# EAGLE design EngineCard (EAGLE 9.6.2)
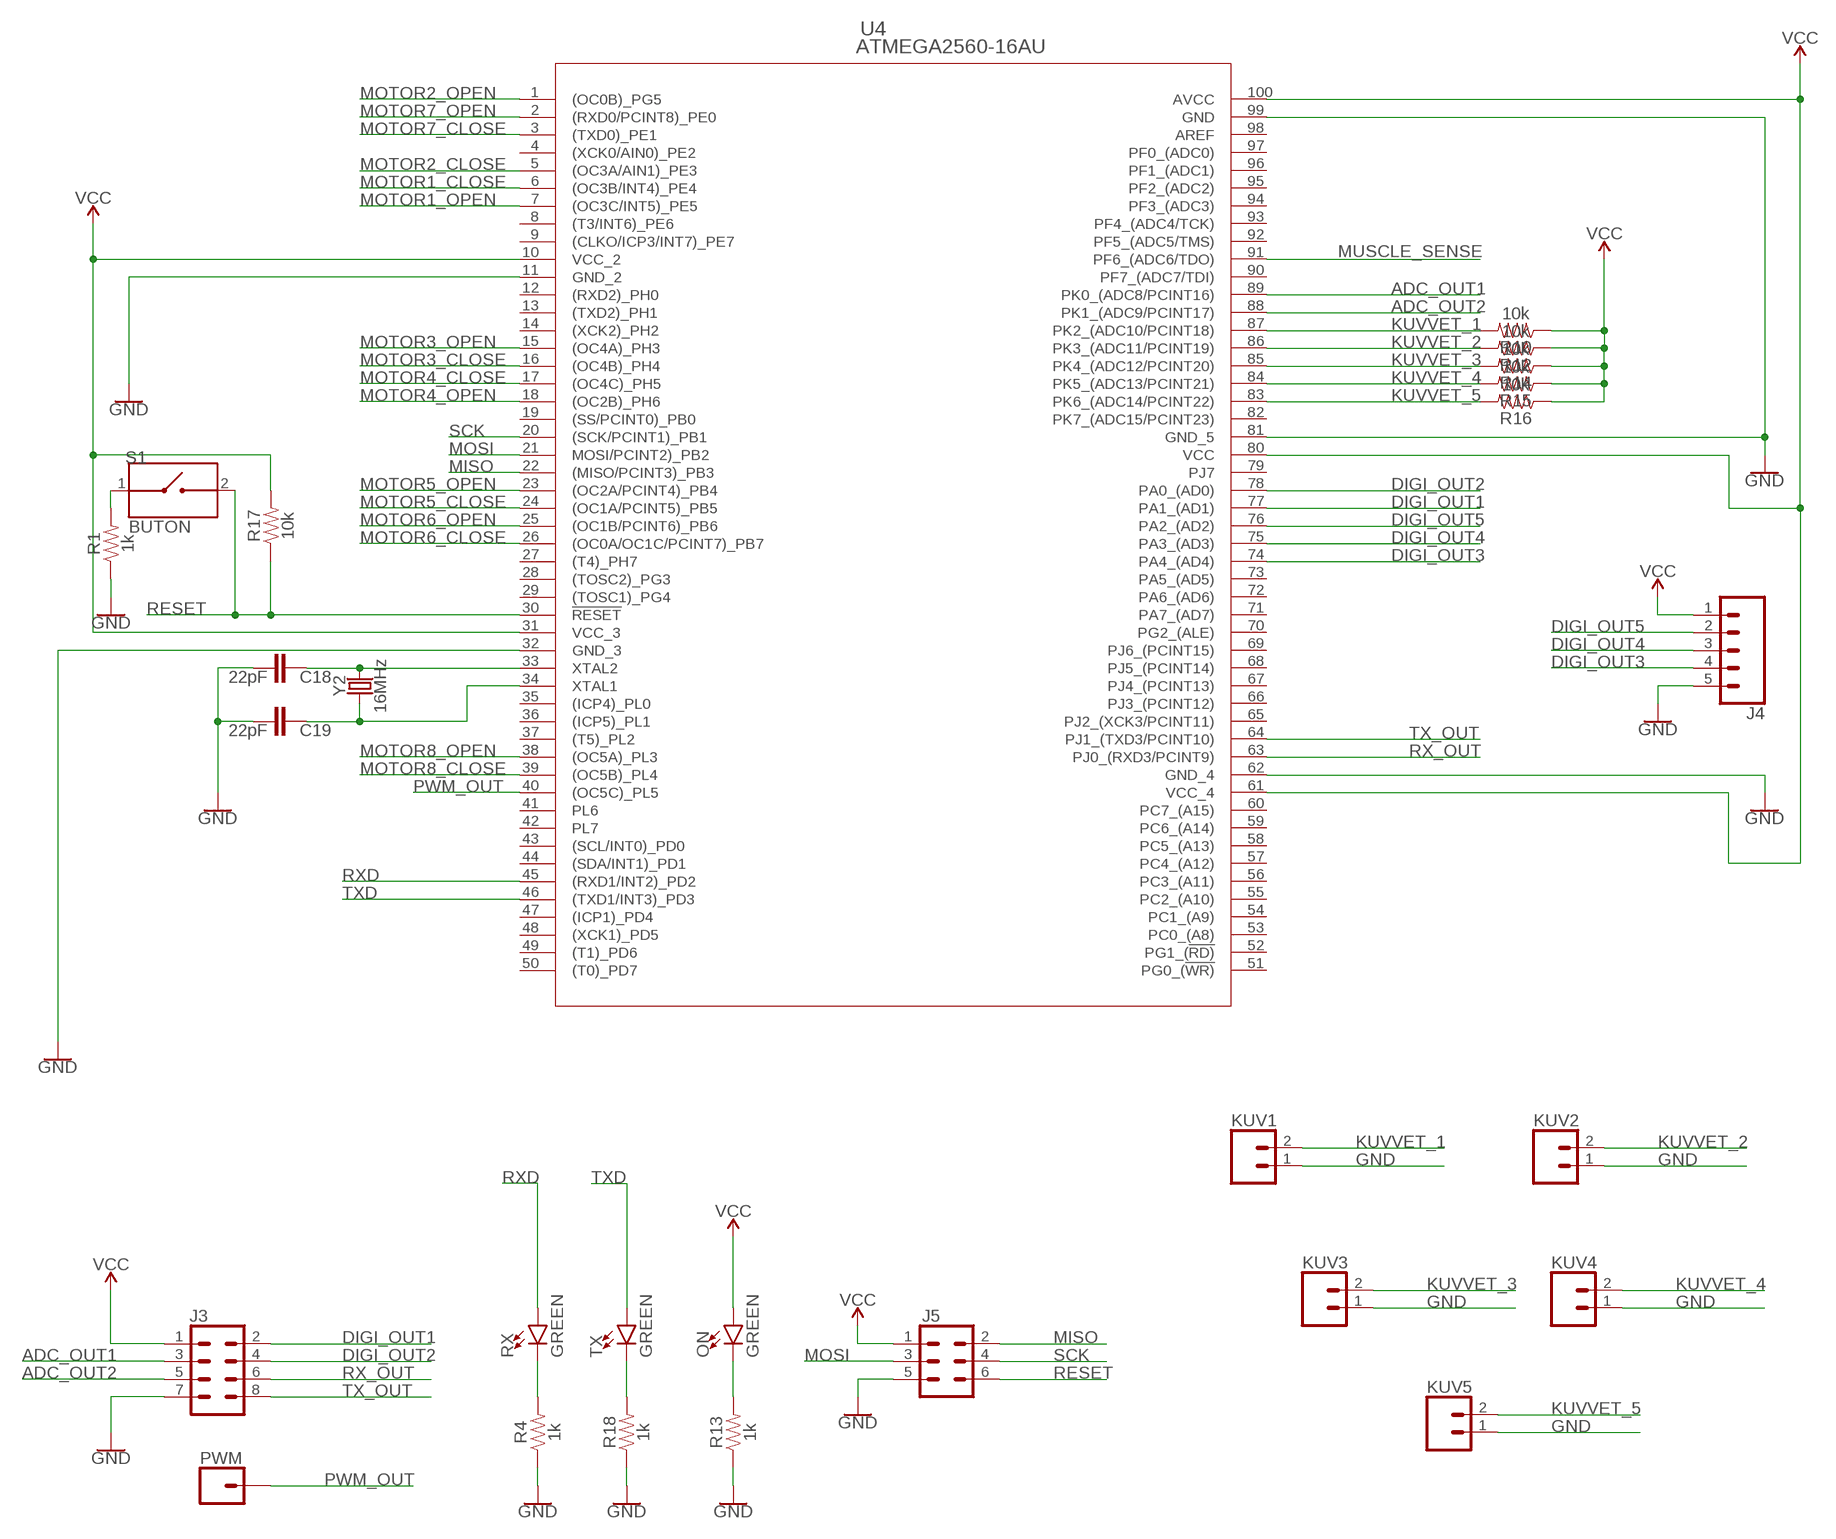
[diagram p0: schematic, sheet 1, part 1 of 2]
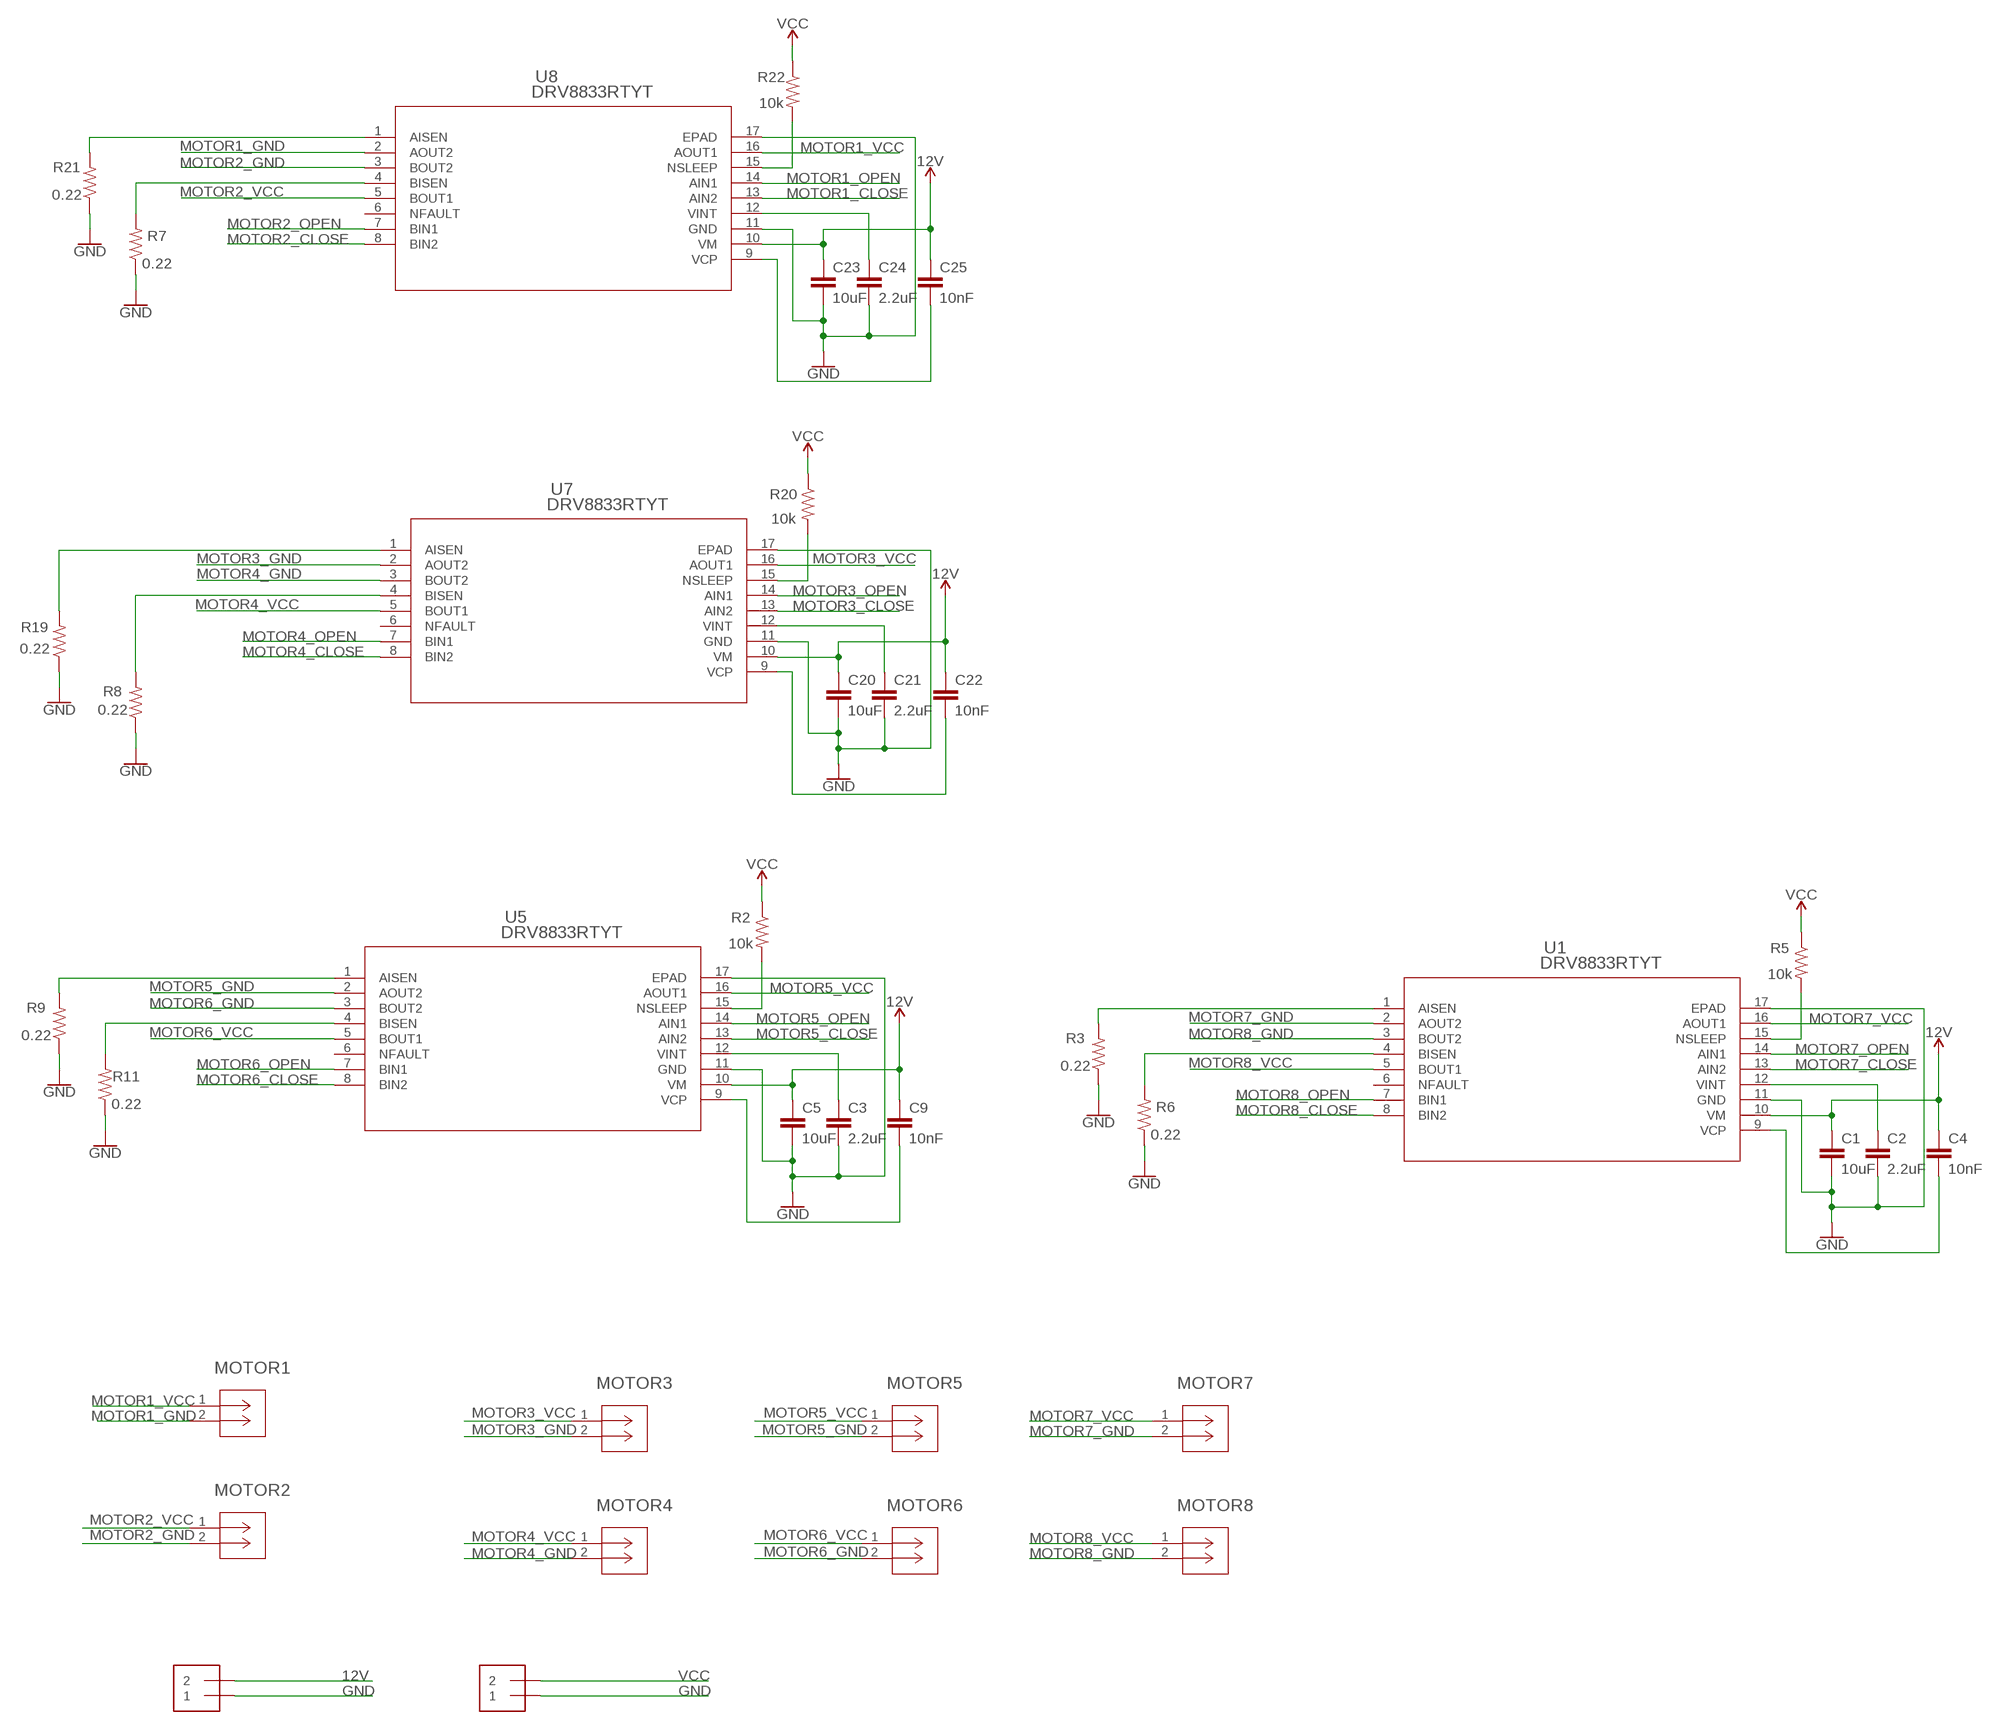
[diagram p1: schematic, sheet 1, part 2 of 2]

## Parts
C1  10uF  10UF-0603-6.3V-20%  [0603]
C2  2.2uF  2.2UF-0603-10V-20%  [0603]
C3  2.2uF  2.2UF-0603-10V-20%  [0603]
C4  10nF  10NF-0603-50V-10%  [0603]
C5  10uF  10UF-0603-6.3V-20%  [0603]
C9  10nF  10NF-0603-50V-10%  [0603]
C18  22pF  22PF-0603-50V-5%  [0603]
C19  22pF  22PF-0603-50V-5%  [0603]
C20  10uF  10UF-0603-6.3V-20%  [0603]
C21  2.2uF  2.2UF-0603-10V-20%  [0603]
C22  10nF  10NF-0603-50V-10%  [0603]
C23  10uF  10UF-0603-6.3V-20%  [0603]
C24  2.2uF  2.2UF-0603-10V-20%  [0603]
C25  10nF  10NF-0603-50V-10%  [0603]
J3  CONN_04X2  [2X4]
J4  CONN_05NO_SILK  [1X05_NO_SILK]
J5  CONN_03X2NO_SILK  [2X3-NS]
KUV1  CONN_02  [1X02]
KUV2  CONN_02  [1X02]
KUV3  CONN_02  [1X02]
KUV4  CONN_02  [1X02]
KUV5  CONN_02  [1X02]
MOTOR1  530470210  [CON_530470210_MOL]
MOTOR2  530470210  [CON_530470210_MOL]
MOTOR3  530470210  [CON_530470210_MOL]
MOTOR4  530470210  [CON_530470210_MOL]
MOTOR5  530470210  [CON_530470210_MOL]
MOTOR6  530470210  [CON_530470210_MOL]
MOTOR7  530470210  [CON_530470210_MOL]
MOTOR8  530470210  [CON_530470210_MOL]
ON  GREEN  LED-GREEN0603  [LED-0603]
PIL  1X2-3.5MM  [1X2-3.5MM]
PWM  CONN_01  [1X01]
R1  1k  10KOHM-0603-1/10W-1%  [0603]
R2  10k  10KOHM-0603-1/10W-1%  [0603]
R3  0.22  0.22OHM-0805-1/4W-1%  [0805]
R4  1k  1KOHM-0603-1/10W-1%  [0603]
R5  10k  10KOHM-0603-1/10W-1%  [0603]
R6  0.22  0.22OHM-0805-1/4W-1%  [0805]
R7  0.22  0.22OHM-0805-1/4W-1%  [0805]
R8  0.22  0.22OHM-0805-1/4W-1%  [0805]
R9  0.22  0.22OHM-0805-1/4W-1%  [0805]
R10  10k  10KOHM-0603-1/10W-1%  [0603]
R11  0.22  0.22OHM-0805-1/4W-1%  [0805]
R12  10k  10KOHM-0603-1/10W-1%  [0603]
R13  1k  1KOHM-0603-1/10W-1%  [0603]
R14  10k  10KOHM-0603-1/10W-1%  [0603]
R15  10k  10KOHM-0603-1/10W-1%  [0603]
R16  10k  10KOHM-0603-1/10W-1%  [0603]
R17  10k  10KOHM-0603-1/10W-1%  [0603]
R18  1k  1KOHM-0603-1/10W-1%  [0603]
R19  0.22  0.22OHM-0805-1/4W-1%  [0805]
R20  10k  10KOHM-0603-1/10W-1%  [0603]
R21  0.22  0.22OHM-0805-1/4W-1%  [0805]
R22  10k  10KOHM-0603-1/10W-1%  [0603]
REG  1X2-3.5MM  [1X2-3.5MM]
RX  GREEN  LED-GREEN0603  [LED-0603]
S1  BUTON  1437566-4  [SW_1437566-4]
TX  GREEN  LED-GREEN0603  [LED-0603]
U1  DRV8833RTYT  [RTY16]
U4  ATMEGA2560-16AU  [100A_ATM]
U5  DRV8833RTYT  [RTY16]
U7  DRV8833RTYT  [RTY16]
U8  DRV8833RTYT  [RTY16]
Y2  16MHz  CRYSTAL-16MHZPTH-HC49US  [HC49US]

## Nets
12V: C1.1 C4.1 C5.1 C9.1 C20.1 C22.1 C23.1 C25.1 PIL.2 U1.10(VM) U5.10(VM) U7.10(VM) U8.10(VM)
ADC_OUT1: J3.3 U4.89(PK0_(ADC8/PCINT16))
ADC_OUT2: J3.5 U4.88(PK1_(ADC9/PCINT17))
DIGI_OUT1: J3.2 U4.77(PA1_(AD1))
DIGI_OUT2: J3.4 U4.78(PA0_(AD0))
DIGI_OUT3: J4.4 U4.74(PA4_(AD4))
DIGI_OUT4: J4.3 U4.75(PA3_(AD3))
DIGI_OUT5: J4.2 U4.76(PA2_(AD2))
GND: C1.2 C2.2 C3.2 C5.2 C18.2 C19.2 C20.2 C21.2 C23.2 C24.2 J3.7 J4.5 J5.5 KUV1.1 KUV2.1 KUV3.1 KUV4.1 KUV5.1 PIL.1 R1.1 R3.1 R4.1 R6.1 R7.1 R8.1 R9.1 R11.1 R13.1 R18.1 R19.1 R21.1 REG.1 U1.11(GND) U1.17(EPAD) U4.11(GND_2) U4.32(GND_3) U4.62(GND_4) U4.81(GND_5) U4.99(GND) U5.11(GND) U5.17(EPAD) U7.11(GND) U7.17(EPAD) U8.11(GND) U8.17(EPAD)
KUVVET_1: KUV1.2 R10.2 U4.87(PK2_(ADC10/PCINT18))
KUVVET_2: KUV2.2 R12.2 U4.86(PK3_(ADC11/PCINT19))
KUVVET_3: KUV3.2 R14.2 U4.85(PK4_(ADC12/PCINT20))
KUVVET_4: KUV4.2 R15.2 U4.84(PK5_(ADC13/PCINT21))
KUVVET_5: KUV5.2 R16.2 U4.83(PK6_(ADC14/PCINT22))
MISO: J5.2 U4.22((MISO/PCINT3)_PB3)
MOSI: J5.3 U4.21(MOSI/PCINT2)_PB2)
MOTOR1_CLOSE: U4.6((OC3B/INT4)_PE4) U8.13(AIN2)
MOTOR1_GND: MOTOR1.2 U8.2(AOUT2)
MOTOR1_OPEN: U4.7((OC3C/INT5)_PE5) U8.14(AIN1)
MOTOR1_VCC: MOTOR1.1 U8.16(AOUT1)
MOTOR2_CLOSE: U4.5((OC3A/AIN1)_PE3) U8.8(BIN2)
MOTOR2_GND: MOTOR2.2 U8.3(BOUT2)
MOTOR2_OPEN: U4.1((OC0B)_PG5) U8.7(BIN1)
MOTOR2_VCC: MOTOR2.1 U8.5(BOUT1)
MOTOR3_CLOSE: U4.16((OC4B)_PH4) U7.13(AIN2)
MOTOR3_GND: MOTOR3.2 U7.2(AOUT2)
MOTOR3_OPEN: U4.15((OC4A)_PH3) U7.14(AIN1)
MOTOR3_VCC: MOTOR3.1 U7.16(AOUT1)
MOTOR4_CLOSE: U4.17((OC4C)_PH5) U7.8(BIN2)
MOTOR4_GND: MOTOR4.2 U7.3(BOUT2)
MOTOR4_OPEN: U4.18((OC2B)_PH6) U7.7(BIN1)
MOTOR4_VCC: MOTOR4.1 U7.5(BOUT1)
MOTOR5_CLOSE: U4.24((OC1A/PCINT5)_PB5) U5.13(AIN2)
MOTOR5_GND: MOTOR5.2 U5.2(AOUT2)
MOTOR5_OPEN: U4.23((OC2A/PCINT4)_PB4) U5.14(AIN1)
MOTOR5_VCC: MOTOR5.1 U5.16(AOUT1)
MOTOR6_CLOSE: U4.26((OC0A/OC1C/PCINT7)_PB7) U5.8(BIN2)
MOTOR6_GND: MOTOR6.2 U5.3(BOUT2)
MOTOR6_OPEN: U4.25((OC1B/PCINT6)_PB6) U5.7(BIN1)
MOTOR6_VCC: MOTOR6.1 U5.5(BOUT1)
MOTOR7_CLOSE: U1.13(AIN2) U4.3((TXD0)_PE1)
MOTOR7_GND: MOTOR7.2 U1.2(AOUT2)
MOTOR7_OPEN: U1.14(AIN1) U4.2((RXD0/PCINT8)_PE0)
MOTOR7_VCC: MOTOR7.1 U1.16(AOUT1)
MOTOR8_CLOSE: U1.8(BIN2) U4.39((OC5B)_PL4)
MOTOR8_GND: MOTOR8.2 U1.3(BOUT2)
MOTOR8_OPEN: U1.7(BIN1) U4.38((OC5A)_PL3)
MOTOR8_VCC: MOTOR8.1 U1.5(BOUT1)
MUSCLE_SENSE: U4.91(PF6_(ADC6/TDO))
N$1: R9.2 U5.1(AISEN)
N$2: R1.2 S1.1
N$3: R2.2 U5.15(NSLEEP)
N$4: C4.2 U1.9(VCP)
N$5: R3.2 U1.1(AISEN)
N$6: C2.1 U1.12(VINT)
N$7: R5.2 U1.15(NSLEEP)
N$8: C9.2 U5.9(VCP)
N$9: R6.2 U1.4(BISEN)
N$15: R7.2 U8.4(BISEN)
N$16: R8.2 U7.4(BISEN)
N$17: C3.1 U5.12(VINT)
N$19: R11.2 U5.4(BISEN)
N$20: R4.2 RX.C
N$21: ON.C R13.2
N$40: R18.2 TX.C
N$41: C18.1 U4.33(XTAL2) Y2.2
N$42: C19.1 U4.34(XTAL1) Y2.1
N$43: C22.2 U7.9(VCP)
N$44: R19.2 U7.1(AISEN)
N$45: C21.1 U7.12(VINT)
N$50: R20.2 U7.15(NSLEEP)
N$51: C25.2 U8.9(VCP)
N$52: R21.2 U8.1(AISEN)
N$53: C24.1 U8.12(VINT)
N$58: R22.2 U8.15(NSLEEP)
PWM_OUT: PWM.1 U4.40((OC5C)_PL5)
RESET: J5.6 R17.1 S1.2 U4.30(!RESET)
RX_OUT: J3.6 U4.63(PJ0_(RXD3/PCINT9))
RXD: RX.A U4.45((RXD1/INT2)_PD2)
SCK: J5.4 U4.20((SCK/PCINT1)_PB1)
TX_OUT: J3.8 U4.64(PJ1_(TXD3/PCINT10))
TXD: TX.A U4.46((TXD1/INT3)_PD3)
VCC: J3.1 J4.1 J5.1 ON.A R2.1 R5.1 R10.1 R12.1 R14.1 R15.1 R16.1 R17.2 R20.1 R22.1 REG.2 U4.10(VCC_2) U4.31(VCC_3) U4.61(VCC_4) U4.80(VCC) U4.100(AVCC)
Unconnected: U1.6(NFAULT) U4.4((XCK0/AIN0)_PE2) U4.8((T3/INT6)_PE6) U4.9((CLKO/ICP3/INT7)_PE7) U4.12((RXD2)_PH0) U4.13((TXD2)_PH1) U4.14((XCK2)_PH2) U4.19((SS/PCINT0)_PB0) U4.27((T4)_PH7) U4.28((TOSC2)_PG3) U4.29((TOSC1)_PG4) U4.35((ICP4)_PL0) U4.36((ICP5)_PL1) U4.37((T5)_PL2) U4.41(PL6) U4.42(PL7) U4.43((SCL/INT0)_PD0) U4.44((SDA/INT1)_PD1) U4.47((ICP1)_PD4) U4.48((XCK1)_PD5) U4.49((T1)_PD6) U4.50((T0)_PD7) U4.51(PG0_(!WR)) U4.52(PG1_(!RD)) U4.53(PC0_(A8)) U4.54(PC1_(A9)) U4.55(PC2_(A10)) U4.56(PC3_(A11)) U4.57(PC4_(A12)) U4.58(PC5_(A13)) U4.59(PC6_(A14)) U4.60(PC7_(A15)) U4.65(PJ2_(XCK3/PCINT11)) U4.66(PJ3_(PCINT12)) U4.67(PJ4_(PCINT13)) U4.68(PJ5_(PCINT14)) U4.69(PJ6_(PCINT15)) U4.70(PG2_(ALE)) U4.71(PA7_(AD7)) U4.72(PA6_(AD6)) U4.73(PA5_(AD5)) U4.79(PJ7) U4.82(PK7_(ADC15/PCINT23)) U4.90(PF7_(ADC7/TDI)) U4.92(PF5_(ADC5/TMS)) U4.93(PF4_(ADC4/TCK)) U4.94(PF3_(ADC3)) U4.95(PF2_(ADC2)) U4.96(PF1_(ADC1)) U4.97(PF0_(ADC0)) U5.6(NFAULT) U7.6(NFAULT) U8.6(NFAULT)

## Power pins joined to a net without a drawn wire
AREF: U4.98(AREF)

## Library data of the parts
C1 C5 C20 C23 = SparkFun-Capacitors:10UF: 10.0µF ceramic capacitors A capacitor is a passive two-terminal electrical component used to store electrical energy temporarily in an electric field.; PROD_ID: CAP-11015
C2 C3 C21 C24 = SparkFun-Capacitors:2.2UF: 2.2µF ceramic capacitors A capacitor is a passive two-terminal electrical component used to store electrical energy temporarily in an electric field.; PROD_ID: CAP-07888
C4 C9 C22 C25 = SparkFun-Capacitors:10NF: 0.01uF/10nF/10,000pF ceramic capacitors A capacitor is a passive two-terminal electrical component used to store electrical energy temporarily in an electric field. CAP-09321; PROD_ID: CAP-00867
C18 C19 = SparkFun-Capacitors:22PF: 22pF ceramic capacitors A capacitor is a passive two-terminal electrical component used to store electrical energy temporarily in an electric field.; PROD_ID: CAP-07876
J3 = SparkFun-Connectors:CONN_04X2: Multi connection point. Often used as Generic Header-pin footprint for 0.1 inch spaced/style header connections On any of the 0.1 inch spaced packages, you can populate with these: Break Away Headers - Straight <https://www.sparkfun.com/products/116> (PRT-00116) Break Away Male Headers - Right Angle <https://www.sparkfun.com/products/553> (PRT-00553) Female Headers <https://www.sparkfun.com/products/115> (PRT-00115) Break Away Headers - Machine Pin <https://www.sparkfun.com/products/117> (PRT-00117) Break Away Female Headers - Swiss Machine Pin <https://www.sparkfun.com/products/743> (PRT-00743)
J4 = SparkFun-Connectors:CONN_05: Multi connection point. Often used as Generic Header-pin footprint for 0.1 inch spaced/style header connections On any of the 0.1 inch spaced packages, you can populate with these: Break Away Headers - Straight <https://www.sparkfun.com/products/116> (PRT-00116) Break Away Male Headers - Right Angle <https://www.sparkfun.com/products/553> (PRT-00553) Female Headers <https://www.sparkfun.com/products/115> (PRT-00115) Break Away Headers - Machine Pin <https://www.sparkfun.com/products/117> (PRT-00117) Break Away Female Headers - Swiss Machine Pin <https://www.sparkfun.com/products/743> (PRT-00743) For SCREWTERMINALS and SPRING TERMINALS visit here: Screw Terimnals on SparkFun.com <https://www.sparkfun.com/search/results?term=Screw+Terminals> (5mm/3.5mm/2.54mm spacing) This device is also useful as a general connection point to wire up your design to another part of your project. Our various solder wires solder well into these plated through hole pads. Hook-Up Wire - Assortment (Stranded, 22 AWG) <https://www.sparkfun.com/products/11375> (PRT-11375) Hook-Up Wire - Assortment (Solid Core, 22 AWG) <https://www.sparkfun.com/products/11367> (PRT-11367) View the entire wire category on our website here <https://www.sparkfun.com/categories/141> Special notes: Molex polarized connector foot print use with SKU : PRT-08231 with associated crimp pins and housings. 1MM SMD Version SKU: PRT-10208
J5 = SparkFun-Connectors:CONN_03X2: Multi connection point. Often used as Generic Header-pin footprint for 0.1 inch spaced/style header connections You can populate with any combo of single row headers, but if you'd like an exact match, check these: Header - 2x3 (Male, 0.1") <https://www.sparkfun.com/products/12807> (PRT-12807) Header - 2x3 (Female, 0.1") <https://www.sparkfun.com/products/13010> (PRT-13010) 2x3 Pin Shrouded Header <https://www.sparkfun.com/products/10877> (PRT-10877) On any of the 0.1 inch spaced packages, you can populate with these: Break Away Headers - Straight <https://www.sparkfun.com/products/116> (PRT-00116) Break Away Male Headers - Right Angle <https://www.sparkfun.com/products/553> (PRT-00553) Female Headers <https://www.sparkfun.com/products/115> (PRT-00115) Break Away Headers - Machine Pin <https://www.sparkfun.com/products/117> (PRT-00117) Break Away Female Headers - Swiss Machine Pin <https://www.sparkfun.com/products/743> (PRT-00743) Special note: the shrouded connector mates well with our 3x2 ribbon cables: Ribbon Crimp Connector - 6-pin (2x3, Female) <https://www.sparkfun.com/products/10651> (PRT-10651) Ribbon Cable - 6 wire (15ft) <https://www.sparkfun.com/products/10646> (PRT-10646)
KUV1-KUV5 = SparkFun-Connectors:CONN_02: Multi connection point. Often used as Generic Header-pin footprint for 0.1 inch spaced/style header connections On any of the 0.1 inch spaced packages, you can populate with these: Break Away Headers - Straight <https://www.sparkfun.com/products/116> (PRT-00116) Break Away Male Headers - Right Angle <https://www.sparkfun.com/products/553> (PRT-00553) Female Headers <https://www.sparkfun.com/products/115> (PRT-00115) Break Away Headers - Machine Pin <https://www.sparkfun.com/products/117> (PRT-00117) Break Away Female Headers - Swiss Machine Pin <https://www.sparkfun.com/products/743> (PRT-00743) For SCREWTERMINALS and SPRING TERMINALS visit here: Screw Terimnals on SparkFun.com <https://www.sparkfun.com/search/results?term=Screw+Terminals> (5mm/3.5mm/2.54mm spacing) This device is also useful as a general connection point to wire up your design to another part of your project. Our various solder wires solder well into these plated through hole pads. Hook-Up Wire - Assortment (Stranded, 22 AWG) <https://www.sparkfun.com/products/11375> (PRT-11375) Hook-Up Wire - Assortment (Solid Core, 22 AWG) <https://www.sparkfun.com/products/11367> (PRT-11367) View the entire wire category on our website here <https://www.sparkfun.com/categories/141> Special notes: Molex polarized connector foot print use with: PRT-08233 with associated crimp pins and housings. 2.54_SCREWTERM for use with PRT-10571. 3.5mm Screw Terminal footprints for PRT-08084 5mm Screw Terminal footprints for use with PRT-08432
MOTOR1-MOTOR8 = 0530470210:530470210; COPYRIGHT: Copyright (C) 2022 Ultra Librarian. All rights reserved.; MANUFACTURER_PART_NUMBER: 530470210; MFR_NAME: Molex Connector Corporation
ON RX TX = SparkFun-LED:LED-GREEN: Green SMD LED Used in manufacturing of various products at SparkFun Packages: 0603 - SMD 0603 package [Product Link] <http://www.futureelectronics.com/en/technologies/semiconductors/optoelectronics/leds/Pages/9894312-LTST-C190GKT.aspx?CrossPart=HSMG-C190&IM=0> LilyPad 1206 - SMD1206 LilyPad package [Product Link] <http://www.futureelectronics.com/en/Technologies/Product.aspx?ProductID=IN150NGHARVATEKCORPORATION2049943&IM=0> 1206 - SMD1206 package [Product Link] <http://www.futureelectronics.com/en/technologies/semiconductors/optoelectronics/leds/Pages/8315665-LTST-C150KGKT.aspx?IM=0> 1206 Bottom Mount -SMD 1206 Bottom Mount [Product Link] <http://www.digikey.com/product-detail/en/lite-on-inc/LTST-C230KGKT/160-1456-1-ND/386854> SparkFun Products: Pro Mini 328 -5V <https://www.sparkfun.com/products/821> RedBoard <https://www.sparkfun.com/products/12757> MP3 Trigger <https://www.sparkfun.com/products/13720> Makey Makey <https://www.sparkfun.com/products/11076>; PROD_ID: DIO-00821
PIL REG = adafruit:1X2: 3.5mm Terminal block http://www.ladyada.net/library/pcb/eaglelibrary.html
PWM = SparkFun-Connectors:CONN_01: Single connection point. Often used as Generic Header-pin footprint for 0.1 inch spaced/style header connections On any of the 0.1 inch spaced packages, you can populate with these: Break Away Headers - Straight <https://www.sparkfun.com/products/116> (PRT-00116) Break Away Male Headers - Right Angle <https://www.sparkfun.com/products/553> (PRT-00553) Female Headers <https://www.sparkfun.com/products/115> (PRT-00115) Break Away Headers - Machine Pin <https://www.sparkfun.com/products/117> (PRT-00117) Break Away Female Headers - Swiss Machine Pin <https://www.sparkfun.com/products/743> (PRT-00743) This device is also useful as a general connection point to wire up your design to another part of your project. Our various solder wires solder well into these plated through hole pads. Hook-Up Wire - Assortment (Stranded, 22 AWG) <https://www.sparkfun.com/products/11375> (PRT-11375) Hook-Up Wire - Assortment (Solid Core, 22 AWG) <https://www.sparkfun.com/products/11367> (PRT-11367) View the entire wire category on our website here <https://www.sparkfun.com/categories/141> Special notes: SMTSO-256-ET is a "flush mount" nut for a 4-40 screw. We mostly use this on specialty testbeds; it is a nice way to connect hardware to your PCB at an adjustable hieght. Also note, the SNAP packages are for using a snappable style connector. We sell a baggie of snaps and they are also used on two LilyPad designs: Snap Assortment - 30 pack (male and female) <https://www.sparkfun.com/products/11347> (DEV-11347) LilyPad Arduino SimpleSnap <https://www.sparkfun.com/products/10941> (DEV-10941) LilyPad SimpleSnap Protoboard <https://www.sparkfun.com/products/10940> (DEV-10940)
R1 = SparkFun-Resistors:10KOHM: 10kΩ resistor A resistor is a passive two-terminal electrical component that implements electrical resistance as a circuit element. Resistors act to reduce current flow, and, at the same time, act to lower voltage levels within circuits. - Wikipedia; PROD_ID: RES-00824; VALUE: 10k
R2 R5 R10 R12 R14-R17 R20 R22 = SparkFun-Resistors:10KOHM: 10kΩ resistor A resistor is a passive two-terminal electrical component that implements electrical resistance as a circuit element. Resistors act to reduce current flow, and, at the same time, act to lower voltage levels within circuits. - Wikipedia; PROD_ID: RES-00824
R3 R6-R9 R11 R19 R21 = SparkFun-Resistors:0.22OHM: 0.22Ω resistor A resistor is a passive two-terminal electrical component that implements electrical resistance as a circuit element. Resistors act to reduce current flow, and, at the same time, act to lower voltage levels within circuits. - Wikipedia; PROD_ID: RES-09883
R4 R13 R18 = SparkFun-Resistors:1KOHM: 1kΩ resistor A resistor is a passive two-terminal electrical component that implements electrical resistance as a circuit element. Resistors act to reduce current flow, and, at the same time, act to lower voltage levels within circuits. - Wikipedia; PROD_ID: RES-07856
S1 = 1437566-4:1437566-4: SWITCH TACTILE SPST-NO 0.05A 24V Check prices <https://pricing.snapeda.com/parts/FSMSMTR/TE%20Connectivity/view-part?ref=eda>; AVAILABILITY: In Stock; COMMENT: 1437566-4; CONFIGURATION_POLE-THROW: Single Pole - Single Throw; CONTACT_CURRENT_RATING: 50 mA; DESCRIPTION: Switch Tactile OFF (ON) SPST Rectangular Button Gull Wing 0.05A 12VDC 1.77N SMD T/R; MF: TE Connectivity; MP: FSMSMTR; PACKAGE: None; PRICE: None; PURCHASE-URL: https://pricing.snapeda.com/search/part/FSMSMTR/?ref=eda
U1 U5 U7 U8 = DRV8833:DRV8833RTYT; DATASHEET_URL: http://www.ti.com/lit/gpn/DRV8833; DESCRIPTION: 2A Low Voltage Dual Brushed DC or Single Bipolar Stepper Motor Driver (PWM Ctrl); FAMILY_NAME: BRUSHED DC DRIVER; GENERIC_PART_NUMBER: DRV8833; INDUSTRY_STD_PKG_TYPE: QFN; MANUFACTURER: Texas Instruments; MANUFACTURER_PART_NUMBER: DRV8833RTYT; PACKAGE_DESIGNATOR: RTY; PIN_COUNT: 16; VENDOR: Texas Instruments
U4 = ATMEGA 2560:ATMEGA2560-16AU; BUILT_BY: EMA_UL_Team; MANUFACTURER_PART_NUMBER: ATMEGA2560-16AU; SOURCELIBRARY: Atmel_2011-04-02; VENDOR: Atmel
Y2 = SparkFun-Clocks:CRYSTAL-16MHZ: 16MHz Crystal Digikey Example <http://www.digikey.com/product-search/en?keywords=535-9122-1-ND> Frequency: 16MHz Frequency Stability: ±50ppm Frequency Tolerance: ±20ppm Load Capacitance: 18pF SparkFun Products: Pro Micro -5V/16MHz <https://www.sparkfun.com/products/12640> SparkFun Serial Enabled LCD Kit <https://www.sparkfun.com/products/10097>; PROD_ID: XTAL-08181; SF_ID: COM-00536

## Board
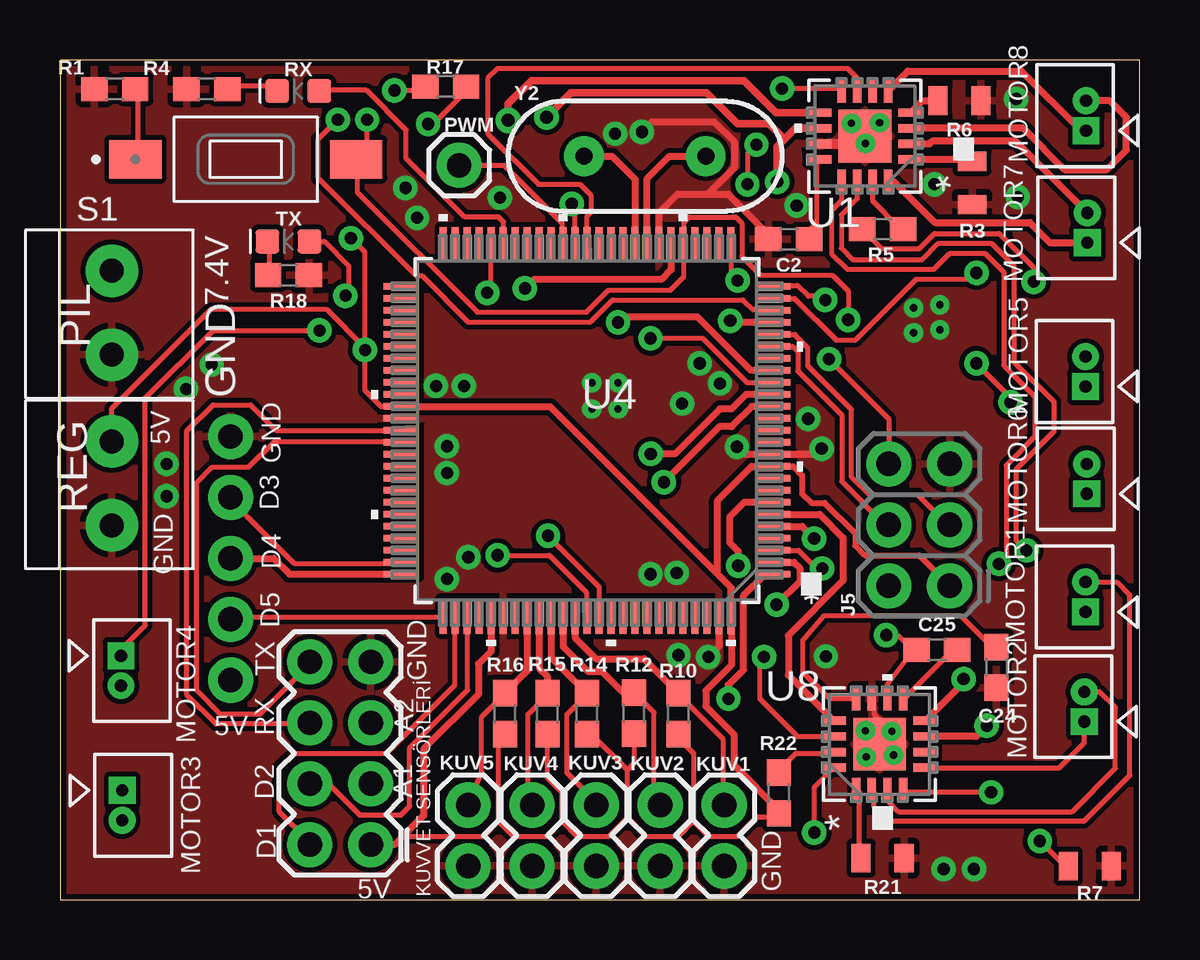
[diagram p2: board, top side]
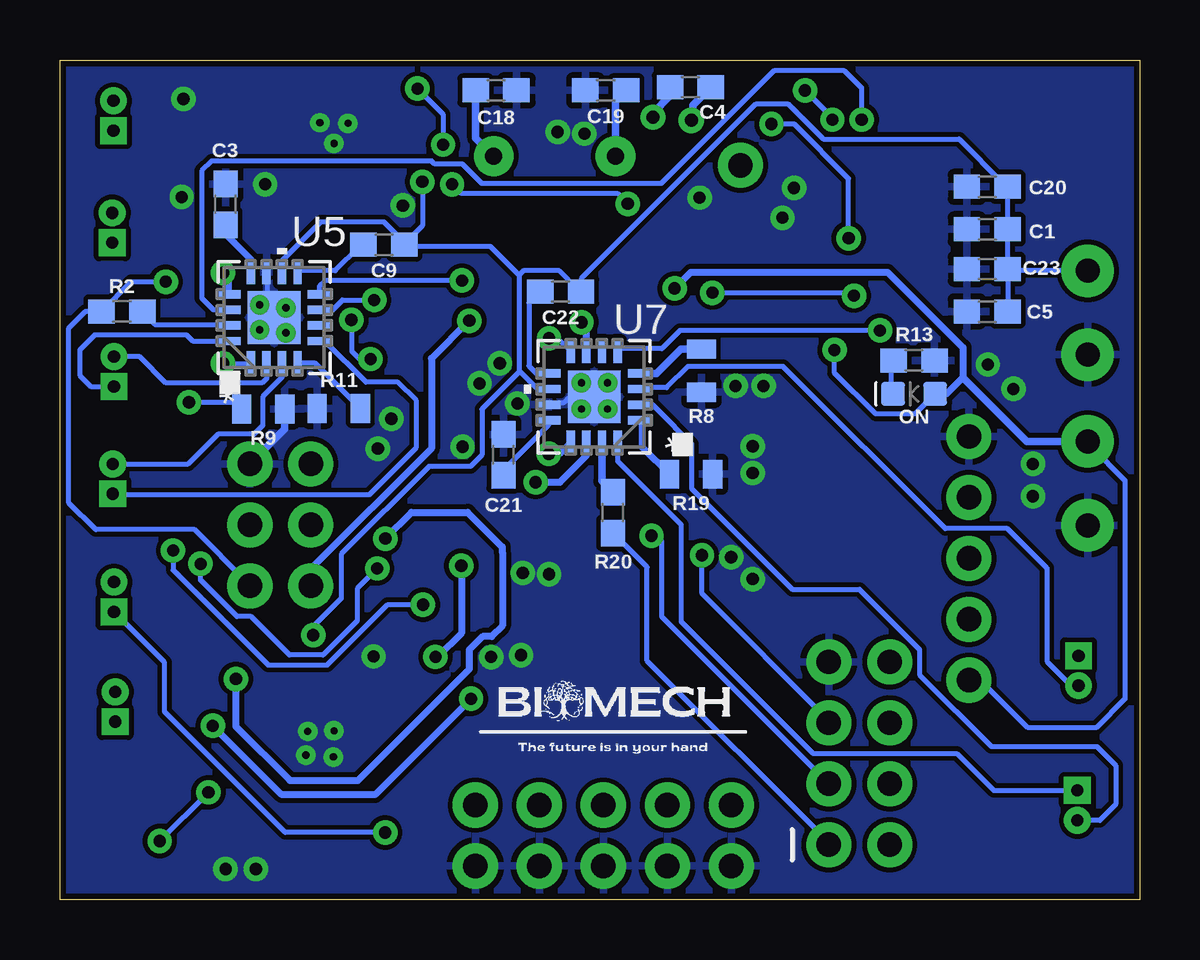
[diagram p3: board, bottom side, seen from below]

Size 45 x 35 mm. Coordinates in mm from the lower left corner, seen from the top.
Outline: 0,0 45,0 45,35 0,35 0,0
Copper layers (1*16): Top 0.035mm / dielectric 1.5mm / Bottom 0.035mm
Design rules "SparkFun": minimum track width 8mil, minimum drill 20mil, track to track 8mil, track to pad 8mil, pad to pad 8mil, via to via 8mil, smd to smd 8mil, copper to edge 10mil, drill to drill 8mil, minimum pad ring 12mil, minimum via ring 10mil, stop-mask expansion 4mil, vias tented up to drill 25mil, thermal gap 10mil

### Footprints (pad centres in the part's own frame; a part is rotated, then mirrored left to right if it is on the bottom)
0603 = smd 1.1 x 1: 1 -0.85,0; 2 0.85,0
2X4 = drill 1.016 pad 1.88: 1 -3.81,-1.27; 2 -3.81,1.27; 3 -1.27,-1.27; 4 -1.27,1.27; 5 1.27,-1.27; 6 1.27,1.27; 7 3.81,-1.27; 8 3.81,1.27
1X05_NO_SILK = drill 1.016 pad 1.88: 1 0,0; 2 2.54,0; 3 5.08,0; 4 7.62,0; 5 10.16,0
2X3-NS = drill 1.016 pad 1.88: 1 -2.54,-1.27; 2 -2.54,1.27; 3 0,-1.27; 4 0,1.27; 5 2.54,-1.27; 6 2.54,1.27
1X02 = drill 1.016 pad 1.88: 1 0,0; 2 2.54,0
CON_530470210_MOL = drill 0.508 pad 0.838 square: 1 0,0 | drill 0.508 pad 0.838: 2 -1.245,0
LED-0603 = smd 1 x 1: A -0.877,0; C 0.877,0
1X2-3.5MM = drill 1 pad 2.184: 1 1.8,0; 2 -1.7,0
1X01 = drill 1.016 pad 1.88: 1 0,0
0805 = smd 0.8 x 1.2: 1 -0.9,0; 2 0.9,0
SW_1437566-4 = smd 2.18 x 1.6: 1 -4.6,0; 2 4.6,0
RTY16 = smd 1 x 0.35: 1 -1.9,0.975; 2 -1.9,0.325; 3 -1.9,-0.325; 4 -1.9,-0.975; 9 1.9,-0.975; 10 1.9,-0.325; 11 1.9,0.325; 12 1.9,0.975 | smd 0.35 x 1: 5 -0.975,-1.9; 6 -0.325,-1.9; 7 0.325,-1.9; 8 0.975,-1.9; 13 0.975,1.9; 14 0.325,1.9; 15 -0.325,1.9; 16 -0.975,1.9 | smd 2.2 x 2.2: 17 0,0 | smd 0.3 x 0.3: V -0.394,-0.394
100A_ATM = smd 1.473 x 0.279: 1 -7.747,6; 2 -7.747,5.5; 3 -7.747,5; 4 -7.747,4.5; 5 -7.747,4; 6 -7.747,3.5; 7 -7.747,3; 8 -7.747,2.5; 9 -7.747,2; 10 -7.747,1.5; 11 -7.747,1; 12 -7.747,0.5; 13 -7.747,0; 14 -7.747,-0.5; 15 -7.747,-1; 16 -7.747,-1.5; 17 -7.747,-2; 18 -7.747,-2.5; 19 -7.747,-3; 20 -7.747,-3.5; 21 -7.747,-4; 22 -7.747,-4.5; 23 -7.747,-5; 24 -7.747,-5.5; 25 -7.747,-6; 51 7.747,-6; 52 7.747,-5.5; 53 7.747,-5; 54 7.747,-4.5; 55 7.747,-4; 56 7.747,-3.5; 57 7.747,-3; 58 7.747,-2.5; 59 7.747,-2; 60 7.747,-1.5; 61 7.747,-1; 62 7.747,-0.5; 63 7.747,0; 64 7.747,0.5; 65 7.747,1; 66 7.747,1.5; 67 7.747,2; 68 7.747,2.5; 69 7.747,3; 70 7.747,3.5; 71 7.747,4; 72 7.747,4.5; 73 7.747,5; 74 7.747,5.5; 75 7.747,6 | smd 0.279 x 1.473: 26 -6,-7.747; 27 -5.5,-7.747; 28 -5,-7.747; 29 -4.5,-7.747; 30 -4,-7.747; 31 -3.5,-7.747; 32 -3,-7.747; 33 -2.5,-7.747; 34 -2,-7.747; 35 -1.5,-7.747; 36 -1,-7.747; 37 -0.5,-7.747; 38 0,-7.747; 39 0.5,-7.747; 40 1,-7.747; 41 1.5,-7.747; 42 2,-7.747; 43 2.5,-7.747; 44 3,-7.747; 45 3.5,-7.747; 46 4,-7.747; 47 4.5,-7.747; 48 5,-7.747; 49 5.5,-7.747; 50 6,-7.747; 76 6,7.747; 77 5.5,7.747; 78 5,7.747; 79 4.5,7.747; 80 4,7.747; 81 3.5,7.747; 82 3,7.747; 83 2.5,7.747; 84 2,7.747; 85 1.5,7.747; 86 1,7.747; 87 0.5,7.747; 88 0,7.747; 89 -0.5,7.747; 90 -1,7.747; 91 -1.5,7.747; 92 -2,7.747; 93 -2.5,7.747; 94 -3,7.747; 95 -3.5,7.747; 96 -4,7.747; 97 -4.5,7.747; 98 -5,7.747; 99 -5.5,7.747; 100 -6,7.747
HC49US = drill 0.7 pad 1.651: 1 -2.54,0; 2 2.54,0

### Placement (x,y rotation side)
C1  6.35,27.94 180 bottom
C2  30.38,27.53 180 top
C3  38.1,28.98 90 bottom
C4  18.72,33.86 0 bottom
C5  6.35,24.51 180 bottom
C9  31.5,27.3 180 bottom
C18  26.82,33.73 0 bottom
C19  22.25,33.73 180 bottom
C20  6.35,29.72 180 bottom
C21  26.52,18.54 90 bottom
C22  24.13,25.35 180 bottom
C23  6.35,26.29 180 bottom
C24  39.04,9.68 270 top
C25  36.55,10.41 0 top
J3  11.68,6.1 90 top
J4  7.11,9.14 90 top
J5  35.81,15.62 90 top
KUV1  27.69,1.4 90 top
KUV2  25.02,1.4 90 top
KUV3  22.35,1.4 90 top
KUV4  19.68,1.4 90 top
KUV5  17.02,1.4 90 top
MOTOR1  42.75,11.99 270 top
MOTOR2  42.7,7.42 270 top
MOTOR3  2.59,4.55 90 top
MOTOR4  2.54,10.16 90 top
MOTOR5  42.75,21.39 270 top
MOTOR6  42.8,16.92 270 top
MOTOR7  42.82,27.38 270 top
MOTOR8  42.77,32.05 270 top
ON  9.4,21.08 180 bottom
PIL  2.16,24.51 270 top
PWM  16.64,30.61 0 top
R1  2.29,33.78 0 top
R2  42.42,24.51 0 bottom
R3  38.02,29.87 90 top
R4  6.12,33.78 0 top
R5  34.29,27.94 0 top
R6  37.49,33.3 180 top
R7  42.93,1.4 180 top
R8  18.26,22.05 90 bottom
R9  36.53,20.45 180 bottom
R10  25.78,7.75 90 top
R11  33.38,20.47 0 bottom
R12  23.93,7.77 90 top
R13  9.4,22.48 180 bottom
R14  21.97,7.75 90 top
R15  20.32,7.75 90 top
R16  18.54,7.75 90 top
R17  16.08,33.88 0 top
R18  9.53,26.04 180 top
R19  18.69,17.73 180 bottom
R20  21.95,16.13 90 bottom
R21  34.29,1.73 180 top
R22  29.97,4.45 90 top
REG  2.16,17.4 270 top
RX  9.93,33.71 180 top
S1  7.75,30.86 0 top
TX  9.53,27.43 180 top
U1  33.55,31.83 180 top
U4  21.97,19.56 180 top
U5  36.07,24.26 90 bottom
U7  22.73,20.95 180 bottom
U8  34.16,6.48 90 top
Y2  24.38,30.99 0 top

### Tracks (layer width: path | path; a pad name or v marks a point on that pad's centre or on a via)
12V  (via drill 0.51, 0.55)
  Top 0.203: 34.49,8.97 35.56,10.36 | C25.1 35.62,10.31 35.56,10.36 | v34.44,11.02 34.9,11.02 35.56,10.36 | U8.10 34.49,8.97 | 34.49,8.97
  Top 0.305: U1.10 30.65,32.15 30.19,31.69 | 30.19,31.69 29.9,31.39 v29.9,29.92 | v20.28,32.61 21.3,33.63 26.94,33.63 28.23,32.33 29.54,32.33 30.19,31.69
  Bottom 0.203: 5.49,26.21 5.49,24.59 C5.1 | 5.49,26.21 2.23,26.21 PIL.2 | 5.49,26.21 C23.1 5.49,26.42 5.49,27.84 C1.1 5.49,28.04 5.49,29.67 C20.1 5.69,29.87 7.52,31.7 13.18,31.7 14.63,33.15 16.01,33.15 23.28,25.88 C22.1 23.4,25.43 24.18,26.21 25.68,26.21 25.86,26.04 | 30.68,27.43 31.5,28.25 34.14,28.25 35.76,26.62 35.76,26.21 U5.10 | 30.68,27.43 30.62,27.37 29.9,28.09 v29.9,29.92 | 30.68,27.43 C9.1 30.48,27.23 27.06,27.23 25.86,26.03 25.86,26.04 | 25.86,22.05 25.15,21.34 24.79,21.34 U7.10 | 25.86,26.04 25.86,22.05 | 25.86,22.05 25.86,22 27.41,20.45 27.41,18.54 27.88,18.06 29.62,18.06 33.27,14.4 33.27,12.55 34.44,11.38 v34.44,11.02
  Bottom 0.305: C4.1 19.57,33.5 20.28,32.79 v20.28,32.61
ADC_OUT1  (via drill 0.51)
  Top 0.203: v20.34,15.16 22.47,13.04 U4.89
  Bottom 0.203: v20.34,15.16 20.14,15.16 19.91,14.94 19.91,11.79 J3.3
ADC_OUT2  (via drill 0.51)
  Top 0.203: v18.24,14.35 20.4,14.35 21.95,12.8 21.95,11.99 U4.88
  Bottom 0.203: v18.24,14.35 18.24,12.75 13.01,7.52 J3.5
DIGI_OUT1
  Top 0.203: U4.77 16.46,11.79 16.46,8.94 13.61,6.1 9.75,6.1 9.14,5.49 9.14,3.66 10.36,2.44 J3.2
DIGI_OUT2
  Top 0.203: J3.4 11.19,4.83 12.49,3.53 14.22,3.53 14.58,3.89 14.58,6.33 16.99,8.74 16.99,11.79 U4.78
DIGI_OUT3
  Top 0.203: U4.74 14.22,14.02 9.75,14.02 7.11,16.66 J4.4
DIGI_OUT4
  Top 0.292: J4.3 8.91,14.22 9.57,13.57 U4.75
DIGI_OUT5
  Top 0.203: U4.76 15.85,11.79 7.11,11.79 J4.2
GND  (via drill 0.3, 0.51)
  Top 0.203: U8.17 34.14,6.5 34.14,7.52 33.93,7.72 33.93,8.33 U8.11 | 33.52,31.7 U1.17
  Top 0.292: v28.22,18.87 28.53,18.56 U4.11 31.51,18.56 v31.75,18.8 | U4.99 27.47,10.55 v27.03,10.11 | U4.32 24.97,28.63 25.75,29.41 27,29.41 | C2.2 29.53,27.73 27.85,29.41 27,29.41 | v24.26,32 24.66,32.41 27.28,32.41 28.11,31.59 28.11,30.51 27,29.41
  Top 0.406: U1.11 33.32,31.5
  Top 0.61: 33.32,31.5 33.52,31.7
  Bottom 0.203: U7.17 22.76,20.93 23.77,20.93 23.98,20.73 24.59,20.73 U7.11 | U5.17 36.37,24.56 36.37,26.01 U5.11
  Bottom 0.305: R9.1 35.62,19.62 J5.5
  other vias: 39.85,33.38 36.83,1.27 38.1,1.27 5.26,21.29 6.32,22.3 25.93,20.68 26.67,22.35 27.51,21.51 15.67,21.41 16.84,21.41 16.13,18.9 16.13,17.78 39.93,29.29 36.45,29.82 16.13,13.36 17.02,14.27 30.71,28.93 31.19,20.04 25.78,10.19 24.61,13.56 25.7,13.61 4.45,18.16 4.45,16.81 18.34,29.26 14.4,29.67 14.88,28.42 23.14,31.93 31.93,10.13 35.59,24.66 36.68,24.79 36.68,23.75 35.59,23.62 33.58,7.04 34.67,7.01 34.75,6.02 33.6,5.94 33.58,31.52 34.16,32.38 32.99,32.36 22.17,21.54 23.27,21.54 22.17,20.45 23.27,20.45
  pour Top: -2.54,36.83 -2.54,-1.42 46.99,-1.42 46.99,36.83
  pour Bottom: -3.81,38.23 -3.81,-2.84 48.26,-2.84 48.26,38.23
KUVVET_1
  Top 0.203: KUV1.2 27.64,4.06 27.64,6.71 25.81,8.53 R10.2
  Top 0.292: U4.87 21.47,10.91 22.35,10.03 24.34,10.03 R10.2
KUVVET_2
  Top 0.203: KUV2.2 24.77,4.19 24.77,7.8 R12.2
  Top 0.292: R12.2 23.49,8.62 22.62,9.5 22.03,9.5 20.98,10.55 U4.86
KUVVET_3
  Top 0.203: R14.2 21.95,8.53 21.13,7.72 21.13,5.28 22.35,4.06 KUV3.2
  Top 0.292: U4.85 20.47,10.1 R14.2
KUVVET_4
  Top 0.203: R15.2 20.32,8.53 19.51,7.72 19.51,4.06 KUV4.2
  Top 0.292: U4.84 19.98,9.64 20.32,9.29 R15.2
KUVVET_5
  Top 0.203: R16.2 18.49,8.53 17.58,7.62 17.58,5.33 KUV5.2
  Top 0.292: U4.83 19.47,9.53 R16.2
MISO  (via drill 0.51)
  Top 0.292: U4.22 28.01,24.06 v27.94,24.13
  Bottom 0.292: v27.94,24.13 29.52,22.55 29.52,18.8 34.54,13.77 J5.2
MOSI
  Top 0.203: J5.3 36.98,15.65 35.76,16.87 33.73,16.87 32.99,17.6 32.99,20.42 31.17,22.25 31.17,23.01 30.62,23.55 30.64,23.55 30.63,23.56 U4.21
MOTOR1_CLOSE
  Top 0.292: U8.13 30.36,9.36 30.36,11.01 32.64,13.29 32.64,15.08 31.67,16.06 U4.6
MOTOR1_GND
  Top 0.203: U8.2 33.93,4.47 33.93,3.86 34.54,3.25 42.67,3.25 44.6,5.18 44.6,12.68 44.04,13.23 MOTOR1.2
MOTOR1_OPEN  (via drill 0.51)
  Top 0.203: U8.14 30.74,6.8 29.16,8.38 29.16,9.93 v29.35,10.11
  Top 0.292: U4.7 28.52,16.56 27.91,15.95 27.91,14.89 28.27,14.53 v28.27,13.92
  Bottom 0.292: v28.27,13.92 28.27,11.1 29.26,10.11 v29.35,10.11
MOTOR1_VCC  (via drill 0.51)
  Top 0.203: v31.45,2.79 31.45,4.68 U8.16
  Bottom 0.203: v31.45,2.79 35.61,2.79 40.64,7.82 40.64,9.88 MOTOR1.1
MOTOR2_CLOSE  (via drill 0.51)
  Top 0.292: U8.8 37.67,9.06 v37.67,9.2 | U4.5 30.93,15.56 v31.44,15.05
  Bottom 0.292: v37.67,9.2 37.67,7.21 35.41,4.96 32.58,4.96 27.94,9.6 27.94,10.41 27.38,10.97 27.01,10.97 26.56,11.41 26.56,14.48 26.57,14.47 26.57,14.71 28,16.14 30.35,16.14 v31.44,15.05
MOTOR2_GND
  Top 0.203: U8.3 34.54,4.47 34.54,4.06 34.95,3.66 42.19,3.66 43.99,5.46 43.99,8 43.33,8.66 MOTOR2.2
MOTOR2_OPEN  (via drill 0.51)
  Top 0.292: v38.63,7.24 38.19,6.8 U8.7 | v27.86,8.37 27.86,8.95 28.49,9.58 28.49,12.67 29.38,13.56 U4.1
  Bottom 0.292: v27.86,8.37 31.86,4.37 35.76,4.37 v38.63,7.24
MOTOR2_VCC
  Top 0.203: U8.5 36.17,5.49 41.66,5.49 42.7,6.53 MOTOR2.1
MOTOR3_CLOSE  (via drill 0.51)
  Top 0.292: v24.63,18.58 25.63,18.58 27.51,20.45 27.99,20.45 28.59,21.06 U4.16
  Bottom 0.292: U7.13 24.18,18.58 v24.63,18.58
MOTOR3_GND
  Bottom 0.203: U7.2 20.3,20.63 20.09,20.42 18.67,19 18.67,17.13 14.47,12.93 11.68,12.93 9.17,10.42 9.17,9.37 6.17,6.38 1.78,6.38 0.99,5.59 0.99,3.96 1.65,3.3 MOTOR3.2
MOTOR3_OPEN  (via drill 0.51)
  Top 0.292: v25.17,17.4 27.49,19.71 27.99,19.71 28.84,20.56 U4.15
  Bottom 0.292: v25.17,17.4 24.16,17.4 23.06,18.49 U7.14
MOTOR3_VCC
  Bottom 0.203: U7.16 21.74,18.9 21.74,18.26 19.1,15.62 19.1,11.58 13.61,6.09 7.62,6.09 6.08,4.55 MOTOR3.1
MOTOR4_CLOSE  (via drill 0.51)
  Top 0.203: v24.61,23.39 26.8,23.39 28.65,21.54 29.67,21.54 U4.17
  Bottom 0.203: v24.61,23.39 24.29,23.39 24.25,23.37 24.23,23.38 U7.8
MOTOR4_GND
  Bottom 0.203: U7.3 20.73,21.34 19.71,21.34 18.82,22.23 14.86,22.23 8.1,15.47 5.51,15.47 3.86,13.82 3.86,9.93 2.85,8.91 MOTOR4.2
MOTOR4_OPEN  (via drill 0.51)
  Top 0.292: U4.18 28.8,22.06 26.57,24.28 23.48,24.28 v23.26,24.07
  Bottom 0.292: U7.7 23.06,23.86 v23.26,24.07
MOTOR4_VCC  (via drill 0.51)
  Top 0.203: v10.82,23.72 6.38,23.72 3.56,20.9 3.56,11.43 2.54,10.41 MOTOR4.1
  Bottom 0.203: v10.82,23.72 19.15,23.72 19.91,22.96 21.74,22.96 U7.5
MOTOR5_CLOSE  (via drill 0.51)
  Top 0.203: U4.24 30.62,25.06 32.36,23.32 33.16,23.32 35.69,25.85 37.92,25.85 v38.2,26.13
  Bottom 0.292: U5.13 37.97,25.89 v38.2,26.13
MOTOR5_GND
  Bottom 0.203: U5.2 36.37,22.35 36.37,21.74 36.58,21.54 40.59,21.54 41.68,22.63 MOTOR5.2
MOTOR5_OPEN  (via drill 0.51)
  Top 0.203: v11.58,32.51 10.77,31.7 10.77,30.07 14.83,26.01 15.09,26.01 17.02,24.08 22.12,24.08 23.04,24.99 28.47,24.99 28.88,24.59 29.67,24.59 U4.23
  Bottom 0.203: v11.58,32.51 11.58,33.83 12.29,34.54 15.24,34.54 19.94,29.84 27.41,29.84 28.22,30.66 29.38,30.66 29.51,30.79 38.68,30.79 39.09,30.38 39.09,25.07 38.61,24.59 38,24.59 U5.14
MOTOR5_VCC
  Bottom 0.203: U5.16 39.47,23.28 39.73,23.55 43.54,23.55 44.17,22.91 44.17,21.84 43.71,21.39 MOTOR5.1
MOTOR6_CLOSE  (via drill 0.51)
  Top 0.203: v28.25,25.81 27.96,26.09 U4.26
  Bottom 0.203: v28.25,25.81 33.95,25.81 34.17,25.59 U5.8
MOTOR6_GND
  Bottom 0.203: U5.3 35.74,21.77 36.55,20.96 36.55,19.76 36.91,19.41 38.41,19.41 39.66,18.16 MOTOR6.2
MOTOR6_OPEN  (via drill 0.51)
  Top 0.203: v31.9,24.99 31.75,25.15 31.19,25.15 30.73,25.6 29.87,25.6 U4.25
  Bottom 0.203: U5.7 33.63,24.58 33.22,24.99 v31.9,24.99
MOTOR6_VCC
  Bottom 0.203: MOTOR6.1 42.75,16.87 32.12,16.87 30.14,18.84 30.14,20.79 30.92,21.57 32.25,21.57 33.97,23.28 U5.5
MOTOR7_CLOSE  (via drill 0.51)
  Top 0.203: U4.3 30.78,14.56 31.38,13.96 31.77,13.96 v31.77,13.8 | U1.13 32.58,29.14 32.16,28.72 32.16,26.94 32.82,26.28 36.44,26.28 37.1,26.94 38.55,26.94 39.34,26.16 39.34,22.27 40.65,20.96 40.65,19.3 39.45,18.1 39.45,14.3 v39.14,13.99
  Bottom 0.203: v31.77,13.8 32.61,12.97 32.61,11.62 34.04,10.19 35.43,10.19 37.03,11.79 37.62,11.79 39.14,13.31 v39.14,13.99
MOTOR7_GND
  Top 0.292: U1.2 36.24,31.5 36.37,31.63 39.82,31.63 MOTOR7.2 | MOTOR7.2
MOTOR7_OPEN  (via drill 0.51)
  Top 0.203: U1.14 33.23,29.21 32.56,28.55 32.56,27.15 33.03,26.68 35.94,26.68 36.62,27.36 38.83,27.36 39.77,26.43 39.77,22.41 41.43,20.75 41.43,19.51 39.85,17.93 39.85,14.99 v40.28,14.55
  Top 0.292: v29.87,12.29 30.84,13.26 30.84,13.82 30.59,14.06 U4.2
  Bottom 0.203: v40.28,14.55 40.28,13.73 36.33,9.78 33.86,9.78 31.34,12.29 v29.87,12.29
MOTOR7_VCC
  Top 0.292: U1.16 34.76,29.93 36.46,28.22 40.43,28.22 41.27,27.38 MOTOR7.1
MOTOR8_CLOSE  (via drill 0.51)
  Top 0.203: U4.39 21.47,28.87 v21.34,29.01 | U1.8 32.5,33.81 v30.1,33.81 | v29.03,31.47 28.66,31.1 v28.66,29.82
  Bottom 0.203: v21.34,29.01 21.77,29.44 28.28,29.44 v28.66,29.82 | v30.1,33.81 29.03,32.74 v29.03,31.47
MOTOR8_GND
  Top 0.292: U1.3 40.15,32.15 41.87,30.44 43.64,30.44 44.45,31.25 44.45,32.61 43.76,33.3 MOTOR8.2
MOTOR8_OPEN
  Top 0.203: U1.7 33.23,34.26 32.84,34.64 18.24,34.64 17.83,34.24 17.83,31.93 19.94,29.82 21.67,29.82 22.15,29.34 22.15,28.67 21.97,28.49 U4.38
MOTOR8_VCC
  Top 0.292: U1.5 35.34,34.54 40.08,34.54 42.56,32.05 MOTOR8.1
N$1  (via drill 0.51)
  Top 0.203: v38.2,22.35 39.62,20.93 v39.62,20.73
  Bottom 0.203: v38.2,22.35 37.19,22.35 U5.1 | v39.62,20.73 37.5,20.73 R9.2
N$2
  Top 0.203: R1.2 3.25,33.73 3.25,30.89 S1.1
N$3
  Bottom 0.203: U5.15 38,23.98 41.05,23.98 41.45,24.38 R2.2
N$4  (via drill 0.55)
  Top 0.305: U1.9 29.85,32.8 28.51,34.14 19.65,34.14 18.68,33.17 v18.68,32.49
  Bottom 0.305: C4.2 18.62,33.11 v18.68,32.49
N$5
  Top 0.292: R3.2 37.94,30.85 U1.1
N$6
  Top 0.203: U1.12 31.52,30.72 31.52,28.18 31.23,27.89 C2.1
N$7
  Top 0.203: U1.15 33.88,29.11 34.95,28.04 R5.2
N$8
  Bottom 0.203: U5.9 34.95,26.21 33.53,26.21 32.51,27.23 C9.2
N$9
  Top 0.292: U1.4 35.95,33.3 R6.2
N$15  (via drill 0.51)
  Top 0.203: v38.81,4.47 35.15,4.47 U8.4 | v40.84,2.44 41.86,1.42 R7.2
  Bottom 0.203: v40.84,2.44 v38.81,4.47
N$16
  Bottom 0.305: R8.2 19.11,22.95 20.13,21.93 U7.4
N$17
  Bottom 0.292: C3.1 38.1,27.75 37.04,26.69 U5.12
N$19
  Bottom 0.203: R11.2 34.36,22.36 U5.4
N$20
  Top 0.203: RX.C 8.96,33.93 7.09,33.93 R4.2
N$21
  Bottom 0.203: ON.C 10.36,21.13 10.36,22.35 R13.2
N$40
  Top 0.203: TX.C 8.74,27.43 8.74,26.21 R18.2
N$41
  Top 0.292: U4.33 24.47,30.06 25.4,30.99 Y2.2
  Bottom 0.305: Y2.2 27.67,31.74 C18.1
N$42
  Top 0.292: Y2.1 23.01,30.99 23.97,30.03 U4.34
  Bottom 0.305: C19.1 21.84,33.29 Y2.1
N$43
  Bottom 0.203: C22.2 25.45,24.88 25.45,22.25 25.13,21.93 U7.9
N$44
  Bottom 0.203: 20.73,18.86 20.72,18.85
  Bottom 0.292: 20.73,18.86 20.73,19.91 U7.1 | 20.72,18.85 R19.2
N$45
  Bottom 0.203: U7.12 24.63,19.79 26.52,17.91 C21.1
N$50
  Bottom 0.305: U7.15 22.41,17.44 R20.2
N$51
  Top 0.203: U8.9 35.2,8.38 37.1,10.28 C25.2
N$52
  Top 0.203: U8.1 33.33,4.47 33.33,1.88 R21.2
N$53
  Top 0.203: U8.12 32.07,8.38 30.95,9.49 30.95,10.8 31.85,11.84 37.54,11.84 38.85,10.53 C24.1
N$58
  Top 0.203: U8.15 32.11,6.1 30.68,6.1 30.07,5.49 R22.2
PWM_OUT
  Top 0.203: PWM.1 18.52,30.61 20.93,28.19 20.93,27.43 U4.40
RESET  (via drill 0.51)
  Top 0.203: v13.95,33.73 15.22,33.73 R17.1 | v12.8,32.51 12.8,31.29 12.39,30.89 S1.2 12.39,30.68 12.39,29.49 17.4,24.49 21.95,24.49 22.86,25.4 25.45,25.4 26.01,25.96 26.01,27.23 U4.30 26.01,27.43 26.01,28.25 26.21,28.45 28.17,28.45 28.42,28.19 28.42,26.8 29.2,26.02 32.19,26.02 32.85,25.36 v32.85,24.17 | v32.05,22.53 34.54,20.04 J5.6
  Bottom 0.203: v13.95,33.73 12.8,32.59 v12.8,32.51 | v32.85,24.17 32.84,24.16 32.84,22.86 32.51,22.53 v32.05,22.53
RX_OUT
  Top 0.203: U4.63 9.02,19.56 7.95,20.62 6.38,20.62 5.28,19.53 5.28,8.53 6.5,7.32 10.36,7.32 J3.6
RXD
  Top 0.203: RX.A 10.81,33.73 12.78,33.73 14.43,32.08 14.43,30.89 16.87,28.45 18.29,28.45 18.49,28.25 18.49,27.43 U4.45
SCK
  Top 0.203: J5.4 34.39,15.62 32.59,17.43 32.59,20.2 30.76,22.03 30.76,22.84 30.55,23.06 U4.20
TX_OUT
  Top 0.203: U4.64 14.22,19.1 8.94,19.1 7.87,18.03 6.35,18.03 5.69,17.37 5.69,8.74 6.71,7.72 8.33,7.72 10.36,9.75 J3.8
TXD  (via drill 0.51)
  Top 0.203: TX.A 11.02,27.43 12.04,26.42 12.04,25.31 v11.9,25.17 | v17.8,25.3 17.97,25.46 U4.46
  Bottom 0.203: v11.9,25.17 12.03,25.3 v17.8,25.3
VCC  (via drill 0.51)
  Top 0.203: R17.2 16.93,33.69 15.57,32.33 v15.34,32.33 | R14.1 22.14,6.91 23.65,5.4 | 26.42,3.25 27.03,2.64 28.25,2.64 29.06,3.45 29.87,3.45 R22.1 | 26.42,3.25 26.42,6.1 25.81,6.71 R10.1 | 18.29,3.25 18.29,6.5 18.49,6.71 R16.1 | 18.29,3.25 17.68,2.64 14.3,2.64 13.95,2.29 | R15.1 20.32,5.08 20.93,4.47 20.93,3.25 | 20.93,3.25 20.32,2.64 18.9,2.64 18.29,3.25 | 26.42,3.25 25.81,2.64 24.41,2.64 23.65,3.4 | 20.93,3.25 21.54,2.64 22.89,2.64 23.65,3.4 | REG.2 2.16,20.47 6.27,24.59 11.12,24.59 12.72,22.99 12.72,21.21 13.39,20.55 14.22,20.55 U4.61 | v12.71,22.91 12.71,26.98 v12.12,27.57 | 23.65,3.4 23.65,5.4 | R12.1 23.93,5.67 23.65,5.4 | R5.1 34.24,27.14 35.82,27.14 36.45,27.77 39.16,27.77 40.59,26.34 v40.59,25.76
  Top 0.254: J5.1 35.81,14.35 33.55,14.35 33.15,14.76 33.15,15.25 31.87,16.53 31.32,16.53 30.94,16.92 30.94,17.69 30.57,18.06 U4.10
  Top 0.292: U4.10 28.83,18.06 27.41,16.64 27.41,13.56 | U4.80 17.97,10.35 17.44,9.82 17.44,8.55 15.16,6.27 15.16,3.5 13.95,2.29 J3.1 | R22.1 29.97,3.72 28.09,5.61 28.09,6.89 26.93,8.05 26.93,8.71 28,9.79 28,11.79 U4.100 27.97,13.01 27.41,13.56 | 27.41,13.56 20.43,20.55 14.23,20.55 U4.61 | U4.31 25.47,26.26 25.06,25.85 19.78,25.85 19.4,25.48 v19.38,25.48
  Bottom 0.203: v15.34,32.33 14.4,32.33 12.12,30.06 v12.12,27.57 | J4.1 6.63,9.14 4.65,7.16 1.8,7.16 0.61,8.36 0.61,17.48 2.03,18.9 REG.2 | J5.1 37.19,13.21 39.4,15.42 43.51,15.42 44.63,16.54 44.63,23.82 43.94,24.51 R2.1 42.02,25.76 v40.59,25.76 | J3.1 13.01,2.44 20.52,9.96 20.52,13.86 R20.1 | ON.A 9.36,20.24 11,20.24 12.71,21.96 v12.71,22.91
  Bottom 0.292: v19.38,25.48 18.7,26.16 10.5,26.16 7.36,23.01 7.36,21.77 8.05,21.08 ON.A
  Bottom 0.305: REG.2 4.69,19.1 7.36,21.77

### Text on the board
tNames: . | MOTOR8 | 7.4V | MOTOR7 | GND | 5V | MOTOR5 | GND | GND | D3 | MOTOR6 | D4 | . | MOTOR4 | D5 | MOTOR1 | TX | GND | 5V | RX | A2 | MOTOR3 | MOTOR2 | D2 | A1 | . | . | D1 | 5V | KUVVET SENSÖRLERİ | GND
bNames: . | .